# EasyEDA schematic 课程设计.json
TITLE: 电子门锁; REV: 1.0; Date: 2024-03-26; Sheet: 1/1; Drawn By: yoitsu; Company: 电子信息工程学院
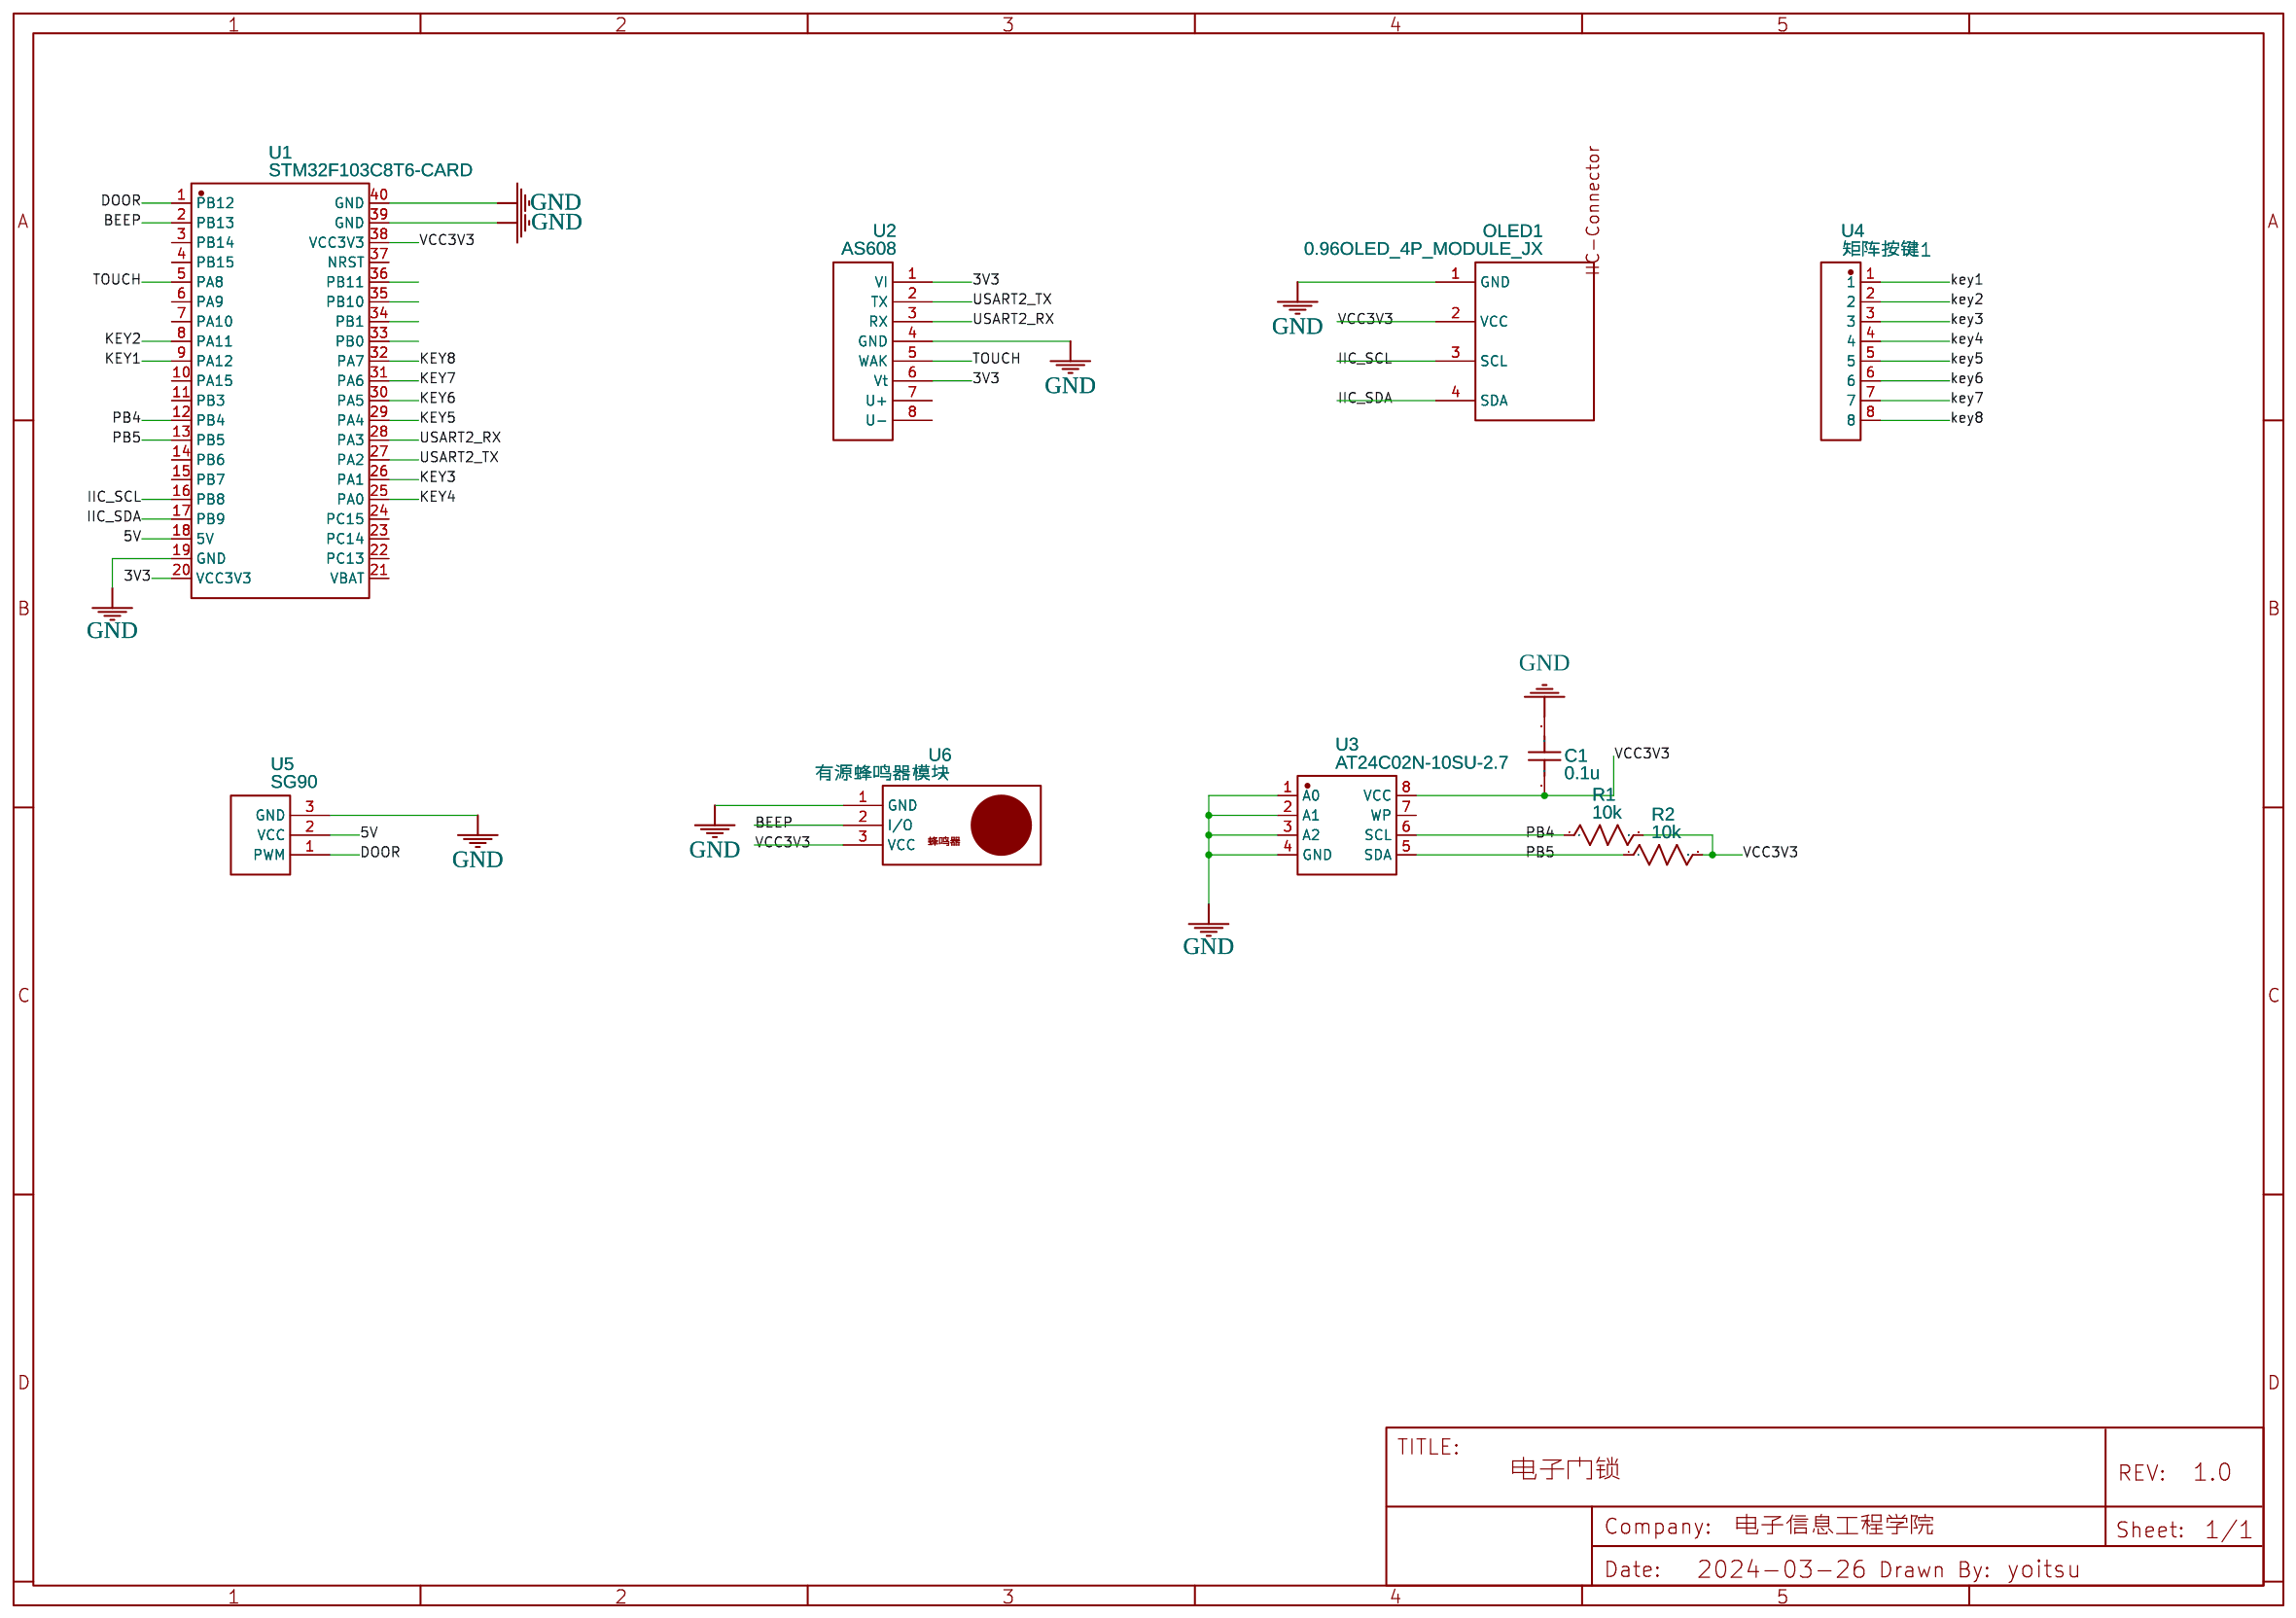
[diagram p0: schematic sheet]

## Parts
C1  0.1u  [C0805]
OLED1  0.96OLED_4P_MODULE_JX  [0.96OLED_4P]
R1  10k  [R0805]
R2  10k  [R0805]
U1  STM32F103C8T6-CARD  [CONN-TH_L53.3-W22.9_STM32F103C8T6-CARD]
U2  AS608  [AS608模块]
U3  AT24C02N-10SU-2.7  [SOIC-8_L4.9-W3.9-P1.27-LS6.0-BL]
U4  矩阵按键1  [HDR-TH_8P-P2.54-V-F]
U5  SG90  [SG90]
U6  有源蜂鸣器模块  [有源蜂鸣器模块]

## Library data of the parts
C1 = C_0603_US: Contributor: LCEDA_Lib
OLED1 = 0.96OLED_4P_MODULE_JX: Contributor: LCSC; Supplier: LCSC; Supplier Part: C9900004566; Manufacturer: null; JLCPCB Part Class: Extended Part
R1 R2 = R_0805_US: Contributor: LCEDA_Lib
U1 = STM32F103C8T6-CARD: Supplier: LCSC; Supplier Part: C9900077949; Manufacturer: null; Manufacturer Part: STM32F103C8T6-Card; Contributor: lcsc
U2 = AS608: Manufacturer: lengyuefeng; Supplier: lengyuefeng; Contributor: FlyingWings
U3 = AT24C02N-10SU-2.7: Contributor: LCSC; Supplier: LCSC; Supplier Part: C2929937; Manufacturer: null; JLCPCB Part Class: Extended Part
U4 = KH-2.54FH-1X8P-H8.5: Contributor: zhouweiming; Supplier: LCSC; Supplier Part: C2905417; Manufacturer: kinghelm(金航标); JLCPCB Part Class: Extended Part; link: https://so.szlcsc.com/global.html?k=C2905417&ref=editor
U5 = SG90: Contributor: zhangwei646
U6 = 有源蜂鸣器模块: Supplier: Rysim; Contributor: Ly1123

## Nets
3V3: U1.20(VCC3V3) U2.1(VI) U2.6(Vt)
5V: U1.18(5V) U5.2(VCC)
GND: C1.2 OLED1.1(GND) U1.19(GND) U1.39(GND) U1.40(GND) U2.4(GND) U3.1(A0) U3.2(A1) U3.3(A2) U3.4(GND) U5.3(GND) U6.1(GND)
VCC3V3: C1.1 OLED1.2(VCC) R1.2 R2.2 U1.38(VCC3V3) U3.8(VCC) U6.3(VCC)
BEEP: U1.2(PB13) U6.2(I/O)
DOOR: U1.1(PB12) U5.1(PWM)
IIC_SCL: OLED1.3(SCL) U1.16(PB8)
IIC_SDA: OLED1.4(SDA) U1.17(PB9)
key1: U4.1
KEY1: U1.9(PA12)
key2: U4.2
KEY2: U1.8(PA11)
key3: U4.3
KEY3: U1.26(PA1)
key4: U4.4
KEY4: U1.25(PA0)
key5: U4.5
KEY5: U1.29(PA4)
key6: U4.6
KEY6: U1.30(PA5)
key7: U4.7
KEY7: U1.31(PA6)
key8: U4.8
KEY8: U1.32(PA7)
PB4: R1.1 U1.12(PB4) U3.6(SCL)
PB5: R2.1 U1.13(PB5) U3.5(SDA)
TOUCH: U1.5(PA8) U2.5(WAK)
USART2_RX: U1.28(PA3) U2.3(RX)
USART2_TX: U1.27(PA2) U2.2(TX)

Not connected (* = marked no-connect by the designer): U1 3(PB14) 4(PB15) 6(PA9) 7(PA10) 10(PA15) 11(PB3) 14(PB6) 15(PB7) 21(VBAT) 22(PC13) 23(PC14) 24(PC15) 33(PB0) 34(PB1) 35(PB10) 36(PB11) 37(NRST); U2 7(U+) 8(U-); U3 7(WP)
